# EAGLE design 519_jetson_nano (EAGLE 9.6.2)
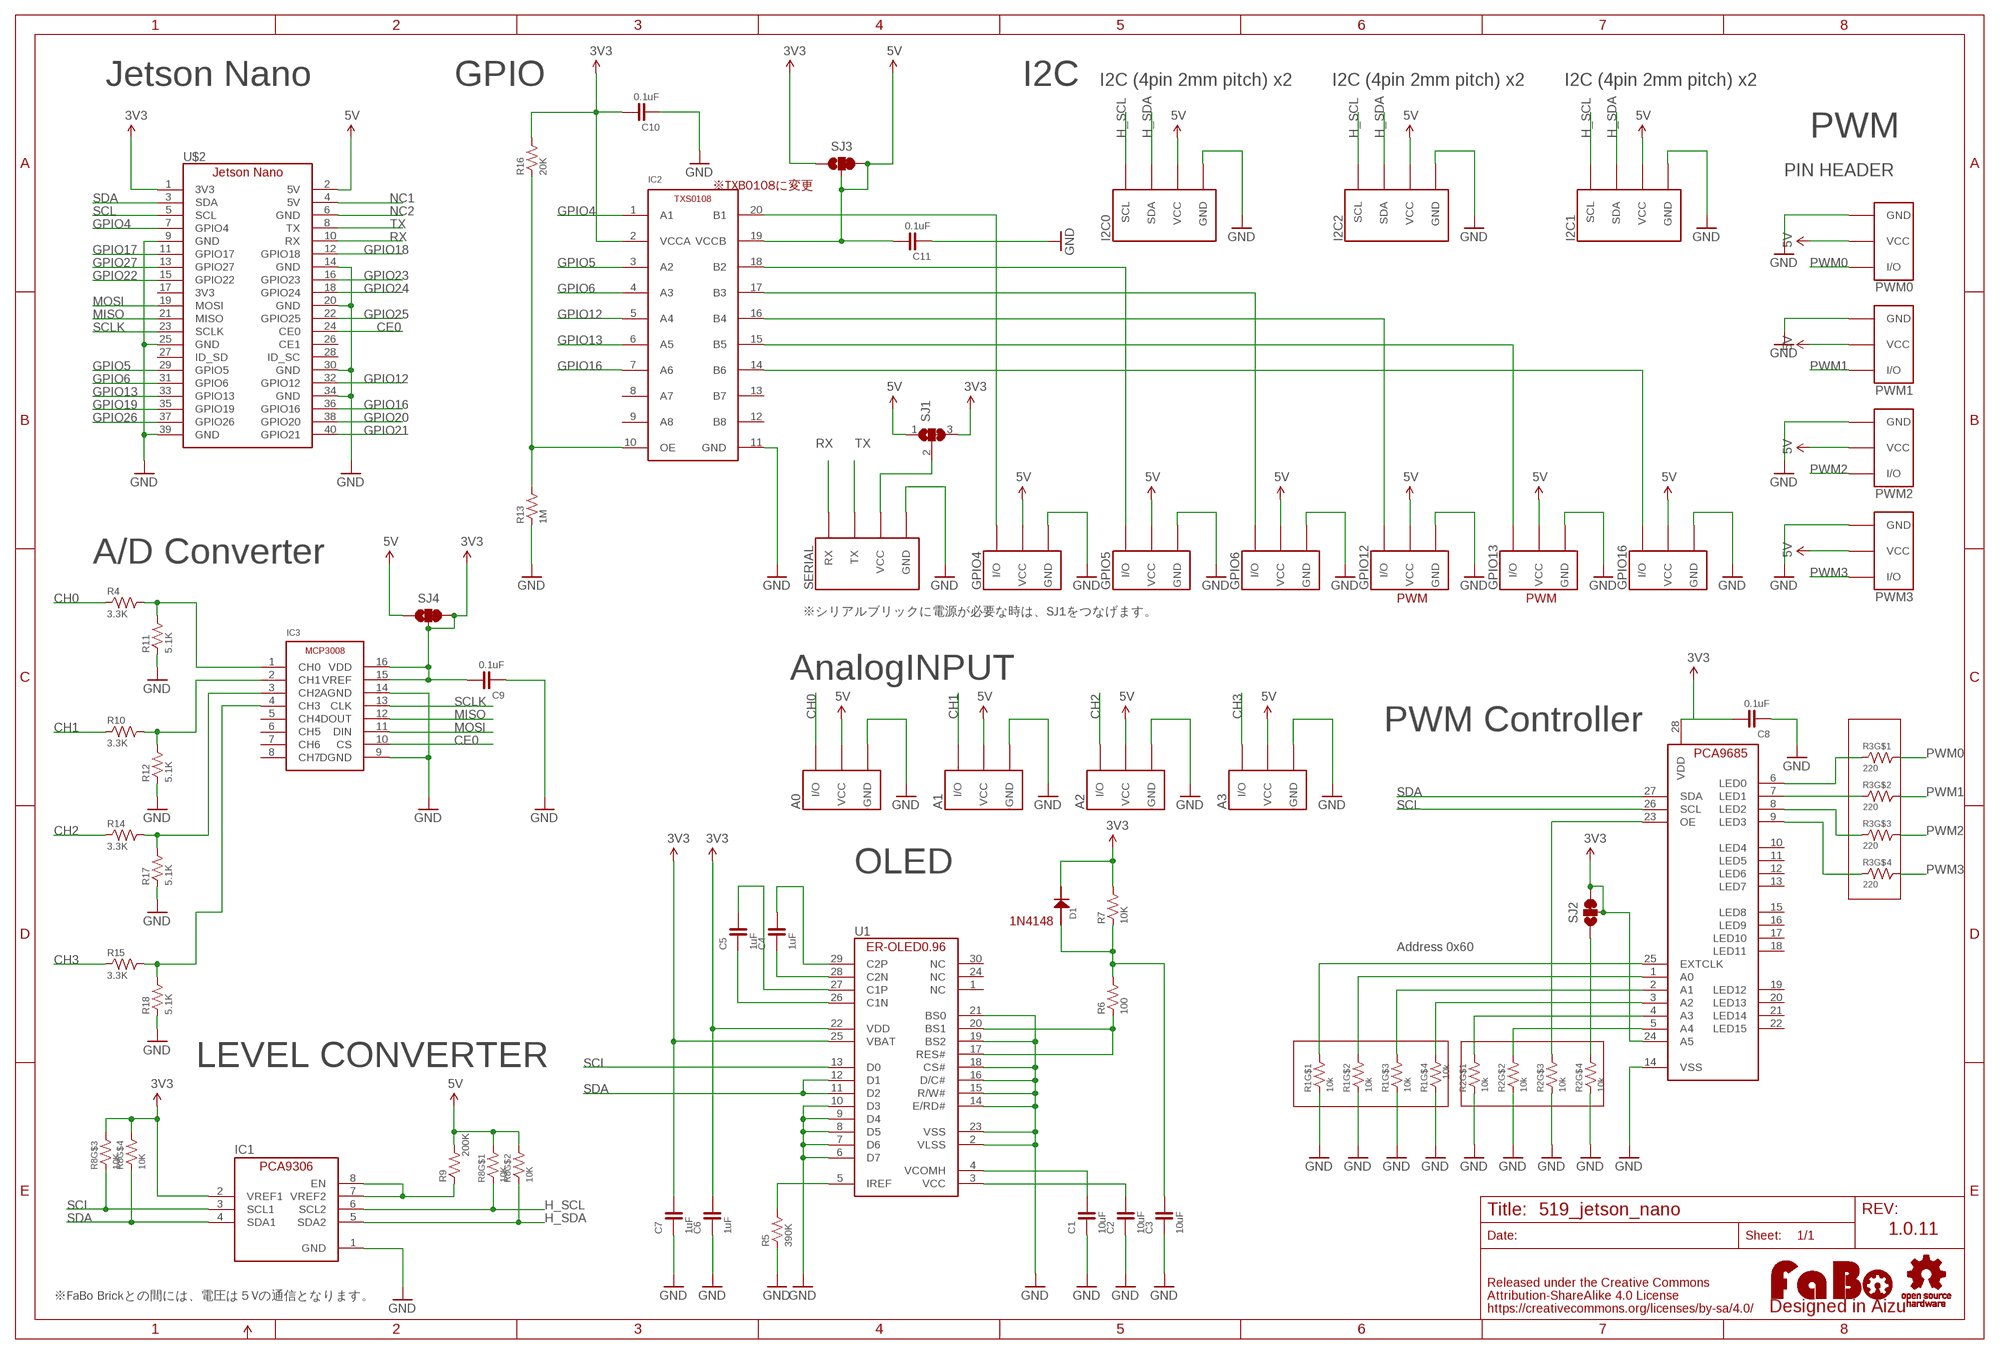
[diagram p0: schematic, sheet 1]

## Parts
A0  FABO_BRICK_3PIN-S03B-PASK-2  [FABO_BRICK_3PIN_S03B-PASK-2]
A1  FABO_BRICK_3PIN-S03B-PASK-2  [FABO_BRICK_3PIN_S03B-PASK-2]
A2  FABO_BRICK_3PIN-S03B-PASK-2  [FABO_BRICK_3PIN_S03B-PASK-2]
A3  FABO_BRICK_3PIN-S03B-PASK-2  [FABO_BRICK_3PIN_S03B-PASK-2]
C1  10uF  CAPACITOR-0603-BOTTOM  [0603-BOTTOM]
C2  10uF  CAPACITOR-0603-BOTTOM  [0603-BOTTOM]
C3  10uF  CAPACITOR-0603-BOTTOM  [0603-BOTTOM]
C4  1uF  CAPACITOR-0603-BOTTOM  [0603-BOTTOM]
C5  1uF  CAPACITOR-0603-BOTTOM  [0603-BOTTOM]
C6  1uF  CAPACITOR-0603-BOTTOM  [0603-BOTTOM]
C7  1uF  CAPACITOR-0603-BOTTOM  [0603-BOTTOM]
C8  0.1uF  CAPACITOR-0603  [0603]
C9  0.1uF  CAPACITOR-0603  [0603]
C10  0.1uF  CAPACITOR-0603  [0603]
C11  0.1uF  CAPACITOR-0603  [0603]
D1  1N4148  [1N4148W]
GPIO4  FABO_BRICK_3PIN-B03B-PASK-1  [FABO_BRICK_3PIN_B03B-PASK-1]
GPIO5  FABO_BRICK_3PIN-B03B-PASK-1  [FABO_BRICK_3PIN_B03B-PASK-1]
GPIO6  FABO_BRICK_3PIN-B03B-PASK-1  [FABO_BRICK_3PIN_B03B-PASK-1]
GPIO12  FABO_BRICK_3PIN-B03B-PASK-1  [FABO_BRICK_3PIN_B03B-PASK-1]
GPIO13  FABO_BRICK_3PIN-B03B-PASK-1  [FABO_BRICK_3PIN_B03B-PASK-1]
GPIO16  FABO_BRICK_3PIN-B03B-PASK-1  [FABO_BRICK_3PIN_B03B-PASK-1]
I2C0  FABO_BRICK_I2C-S04B-PASK-2  [FABO_BRICK_I2C_S04B-PASK-2]
I2C1  FABO_BRICK_I2C-B04B-PASK-1  [FABO_BRICK_I2C_B04B-PASK-1]
I2C2  FABO_BRICK_I2C-B04B-PASK-1  [FABO_BRICK_I2C_B04B-PASK-1]
IC1  PCA9306_SSOP  [8PIN-SSOP]
IC2  TXS0108  [R-PUSON-N20]
IC3  MICROCHIP-MCP3008  [MICROCHIP-MCP3008]
LOGO1  LOGO_FABO-M  [LOGO_FABO_M]
PWM0  FABO_BRICK_3PIN-HEADER  [FABO_BRICK_3PIN_HEADER]
PWM1  FABO_BRICK_3PIN-HEADER  [FABO_BRICK_3PIN_HEADER]
PWM2  FABO_BRICK_3PIN-HEADER  [FABO_BRICK_3PIN_HEADER]
PWM3  FABO_BRICK_3PIN-HEADER  [FABO_BRICK_3PIN_HEADER]
R1  10k  RESISTOR_ARRAY  [EXBV8V]
R2  10k  RESISTOR_ARRAY  [EXBV8V]
R3  220  RESISTOR_ARRAY  [EXBV8V]
R4  3.3K  RESISTOR-0603-BOTTOM  [0603-BOTTOM]
R5  390K  RESISTOR-0603-BOTTOM  [0603-BOTTOM]
R6  100  RESISTOR-0603-BOTTOM  [0603-BOTTOM]
R7  10K  RESISTOR-0603-BOTTOM  [0603-BOTTOM]
R8  10K  RESISTOR_ARRAY  [EXBV8V]
R9  200K  RESISTOR-0603  [0603]
R10  3.3K  RESISTOR-0603-BOTTOM  [0603-BOTTOM]
R11  5.1K  RESISTOR-0603-BOTTOM  [0603-BOTTOM]
R12  5.1K  RESISTOR-0603-BOTTOM  [0603-BOTTOM]
R13  1M  RESISTOR-0603-BOTTOM  [0603-BOTTOM]
R14  3.3K  RESISTOR-0603-BOTTOM  [0603-BOTTOM]
R15  3.3K  RESISTOR-0603-BOTTOM  [0603-BOTTOM]
R16  20K  RESISTOR-0603-BOTTOM  [0603-BOTTOM]
R17  5.1K  RESISTOR-0603-BOTTOM  [0603-BOTTOM]
R18  5.1K  RESISTOR-0603-BOTTOM  [0603-BOTTOM]
SERIAL  FABO_BRICK_SERIAL-B04B-PASK-1  [FABO_BRICK_SERIAL_B04B-PASK-1]
SJ1  SJ2W  [SJ_2]
SJ2  SMD-JUMPER-3-23SHORT  [SMD-JUMPER-3]
SJ3  SMD-JUMPER-3-23SHORT  [SMD-JUMPER-3]
SJ4  SMD-JUMPER-3-23SHORT  [SMD-JUMPER-3]
U1  ER-OLED0.96-1ER-CON30HT-1  [ER-CON30HT-1]
U$2  JETSON_NANO_WIDE  [JETSON_NANO_WIDE]
U$7  LOGO_OSHW-M_BOTTOM  [LOGO_OSHW_M_BOTTOM]
U$9  PCA9685  [PCA9685]

## Nets
3V3: C6.2 C7.2 C8.2 C9.2 C10.2 D1.CATHODE IC1.2(VREF1) IC2.2(VCCA) IC3.15(VREF) IC3.16(VDD) R7.2 R8.5 R8.6 R16.2 SJ1.3 SJ2.2 SJ2.3 SJ3.1 SJ4.2 SJ4.3 U1.22(VDD) U1.25(VBAT) U$2.1(3V3) U$9.24(A5) U$9.28(VDD)
5V: A0.VCC A1.VCC A2.VCC A3.VCC C11.2 GPIO4.VCC GPIO5.VCC GPIO6.VCC GPIO12.VCC GPIO13.VCC GPIO16.VCC I2C0.VCC I2C1.VCC I2C2.VCC IC2.19(VCCB) PWM0.VCC PWM1.VCC PWM2.VCC PWM3.VCC R8.7 R8.8 R9.2 SJ1.1 SJ3.2 SJ3.3 SJ4.1 U$2.2(5V)
CE0: IC3.10(CS) U$2.24(CE0)
CH0: A0.I/O R4.1
CH1: A1.I/O R10.1
CH2: A2.I/O R14.1
CH3: A3.I/O R15.1
GND: A0.GND A1.GND A2.GND A3.GND C1.1 C2.1 C3.1 C6.1 C7.1 C8.1 C9.1 C10.1 C11.1 GPIO4.GND GPIO5.GND GPIO6.GND GPIO12.GND GPIO13.GND GPIO16.GND I2C0.GND I2C1.GND I2C2.GND IC1.1(GND) IC2.11(GND) IC3.9(DGND) IC3.14(AGND) PWM0.GND PWM1.GND PWM2.GND PWM3.GND R1.1 R1.2 R1.3 R1.4 R2.1 R2.2 R2.3 R2.4 R5.1 R11.1 R12.1 R13.1 R17.1 R18.1 SERIAL.GND U1.2(VLSS) U1.6(D7) U1.7(D6) U1.8(D5) U1.9(D4) U1.10(D3) U1.14(E/RD#) U1.15(R/W#) U1.16(D/C#) U1.18(CS#) U1.19(BS2) U1.21(BS0) U1.23(VSS) U$2.9(GND) U$2.14(GND) U$2.20(GND) U$2.25(GND) U$2.30(GND) U$2.34(GND) U$2.39(GND) U$9.14(VSS)
GPIO4: IC2.1(A1) U$2.7(GPIO4)
GPIO5: IC2.3(A2) U$2.29(GPIO5)
GPIO6: IC2.4(A3) U$2.31(GPIO6)
GPIO12: IC2.5(A4) U$2.32(GPIO12)
GPIO13: IC2.6(A5) U$2.33(GPIO13)
GPIO16: IC2.7(A6) U$2.36(GPIO16)
GPIO17: U$2.11(GPIO17)
GPIO18: U$2.12(GPIO18)
GPIO19: U$2.35(GPIO19)
GPIO20: U$2.38(GPIO20)
GPIO21: U$2.40(GPIO21)
GPIO22: U$2.15(GPIO22)
GPIO23: U$2.16(GPIO23)
GPIO24: U$2.18(GPIO24)
GPIO25: U$2.22(GPIO25)
GPIO26: U$2.37(GPIO26)
GPIO27: U$2.13(GPIO27)
H_SCL: I2C0.SCL I2C1.SCL I2C2.SCL IC1.6(SCL2) R8.1
H_SDA: I2C0.SDA I2C1.SDA I2C2.SDA IC1.5(SDA2) R8.2
MISO: IC3.12(DOUT) U$2.21(MISO)
MOSI: IC3.11(DIN) U$2.19(MOSI)
N$2: R3.1 U$9.6(LED0)
N$3: R3.2 U$9.7(LED1)
N$4: R1.7 U$9.1(A0)
N$5: R3.3 U$9.8(LED2)
N$6: R3.4 U$9.9(LED3)
N$7: R2.6 U$9.23(OE)
N$8: R1.8 U$9.25(EXTCLK)
N$9: GPIO4.I/O IC2.20(B1)
N$10: R1.6 U$9.2(A1)
N$11: R1.5 U$9.3(A2)
N$12: R2.8 U$9.4(A3)
N$13: R2.7 U$9.5(A4)
N$14: C5.2 U1.27(C1P)
N$15: GPIO5.I/O IC2.18(B2)
N$16: C5.1 U1.26(C1N)
N$17: GPIO6.I/O IC2.17(B3)
N$18: GPIO12.I/O IC2.16(B4)
N$19: C4.1 U1.28(C2N)
N$20: GPIO13.I/O IC2.15(B5)
N$21: C4.2 U1.29(C2P)
N$22: GPIO16.I/O IC2.14(B6)
N$23: R5.2 U1.5(IREF)
N$24: C1.2 U1.4(VCOMH)
N$25: C2.2 U1.3(VCC)
N$26: R6.1 U1.17(RES#) U1.20(BS1)
N$27: C3.2 D1.ANODE R6.2 R7.1
N$28: IC2.10(OE) R13.2 R16.1
N$30: SERIAL.VCC SJ1.2
N$31: IC3.3(CH2) R14.2 R17.2
N$33: IC1.7(VREF2) IC1.8(EN) R9.1
N$34: IC3.1(CH0) R4.2 R11.2
N$35: R2.5 SJ2.1
N$36: IC3.2(CH1) R10.2 R12.2
N$38: IC3.4(CH3) R15.2 R18.2
NC1: U$2.4(5V)
NC2: U$2.6(GND)
PWM0: PWM0.I/O R3.8
PWM1: PWM1.I/O R3.7
PWM2: PWM2.I/O R3.6
PWM3: PWM3.I/O R3.5
RX: SERIAL.RX U$2.10(RX)
SCL: IC1.3(SCL1) R8.3 U1.13(D0) U$2.5(SCL) U$9.26(SCL)
SCLK: IC3.13(CLK) U$2.23(SCLK)
SDA: IC1.4(SDA1) R8.4 U1.11(D2) U1.12(D1) U$2.3(SDA) U$9.27(SDA)
TX: SERIAL.TX U$2.8(TX)
Unconnected: IC2.8(A7) IC2.9(A8) IC2.12(B8) IC2.13(B7) IC3.5(CH4) IC3.6(CH5) IC3.7(CH6) IC3.8(CH7) U1.1(NC) U1.24(NC) U1.30(NC) U$2.17(3V3) U$2.26(CE1) U$2.27(ID_SD) U$2.28(ID_SC) U$9.10(LED4) U$9.11(LED5) U$9.12(LED6) U$9.13(LED7) U$9.15(LED8) U$9.16(LED9) U$9.17(LED10) U$9.18(LED11) U$9.19(LED12) U$9.20(LED13) U$9.21(LED14) U$9.22(LED15)

## Notes on the sheet
- Jetson Nano | GPIO | I2C | I2C (4pin 2mm pitch) x2 | I2C (4pin 2mm pitch) x2 | I2C (4pin 2mm pitch) x2
- PWM
- PIN HEADER
- ※TXB0108に変更
- A/D Converter
- PWM | PWM
- ※シリアルブリックに電源が必要な時は、SJ1をつなげます。
- AnalogINPUT
- PWM Controller
- OLED
- 1N4148
- Address 0x60
- LEVEL CONVERTER
- 1.0.11
- ※FaBo Brickとの間には、電圧は５Vの通信となります。

## Library data of the parts
A0 A1-A3 GPIO4-GPIO6 GPIO12 GPIO13 GPIO16 PWM0 PWM1-PWM3 = FaBo-Template:FABO_BRICK_3PIN: FaBo Brick 3pin
C1-C11 = FaBo-Capacitor:CAPACITOR: CAPACITOR
D1 = FaBo-Diode:1N4148
I2C0 I2C1 I2C2 = FaBo-Template:FABO_BRICK_I2C: FaBo Brick I2C
IC1 = FaBo-LevelTranslator:PCA9306
IC2 = FaBo-LevelTranslator:TXS0108
IC3 = FaBo-ADC:MICROCHIP-MCP3008
LOGO1 = component:LOGO_FABO
R1-R3 R8 = component:RESISTOR_ARRAY
R4-R7 R9-R18 = FaBo-Resistors:RESISTOR: RESISTOR
SERIAL = FaBo-Template:FABO_BRICK_SERIAL: FaBo Brick Serial
SJ1 = jumper:SJ2W: SMD solder JUMPER
SJ2-SJ4 = FaBo-etc:SMD-JUMPER-3-23SHORT
U1 = FaBo-Display:ER-OLED0.96-1
U$2 = FaBo-Boards:JETSON_NANO
U$7 = component:LOGO_OSHW
U$9 = FaBo-Motor:PCA9685

## Board
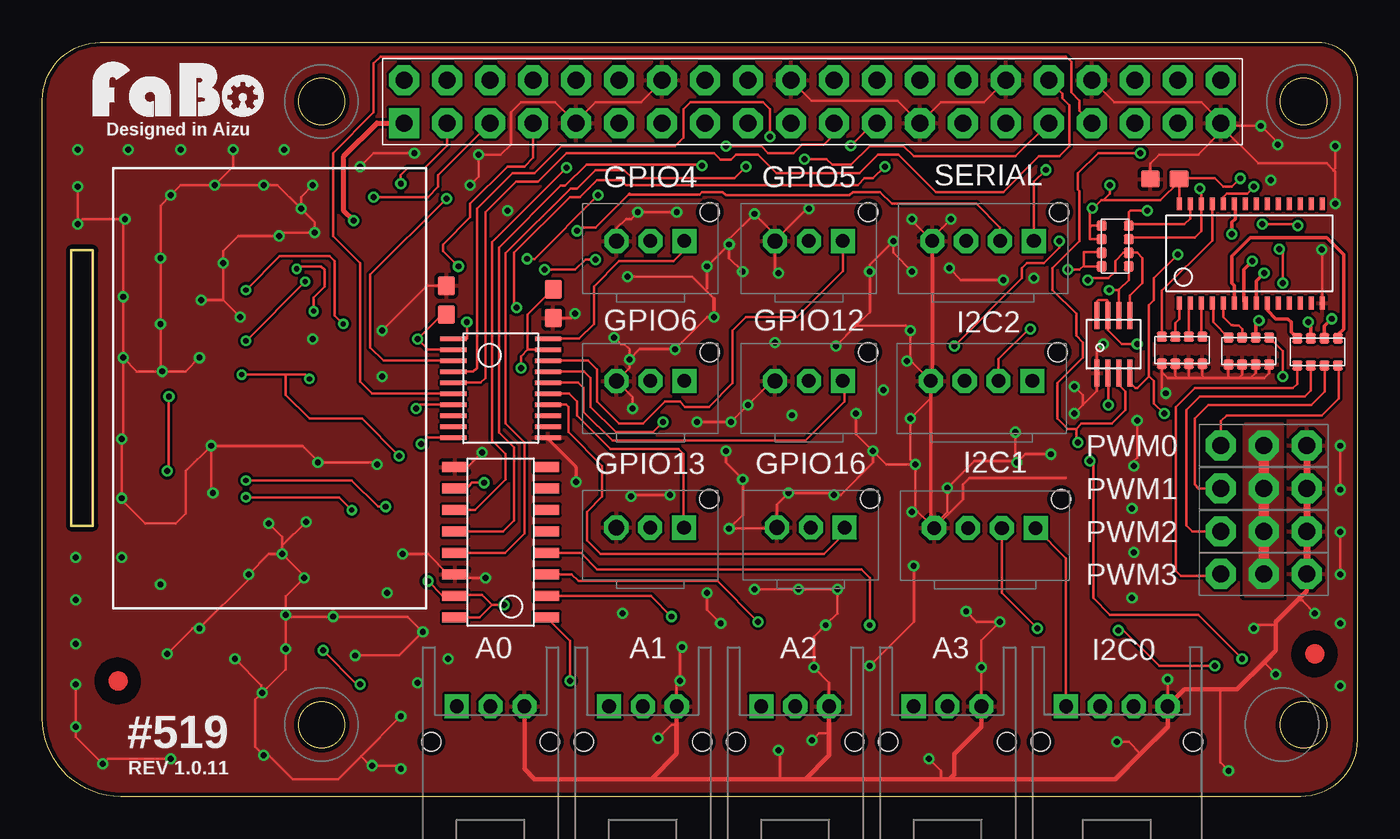
[diagram p1: board, top side]
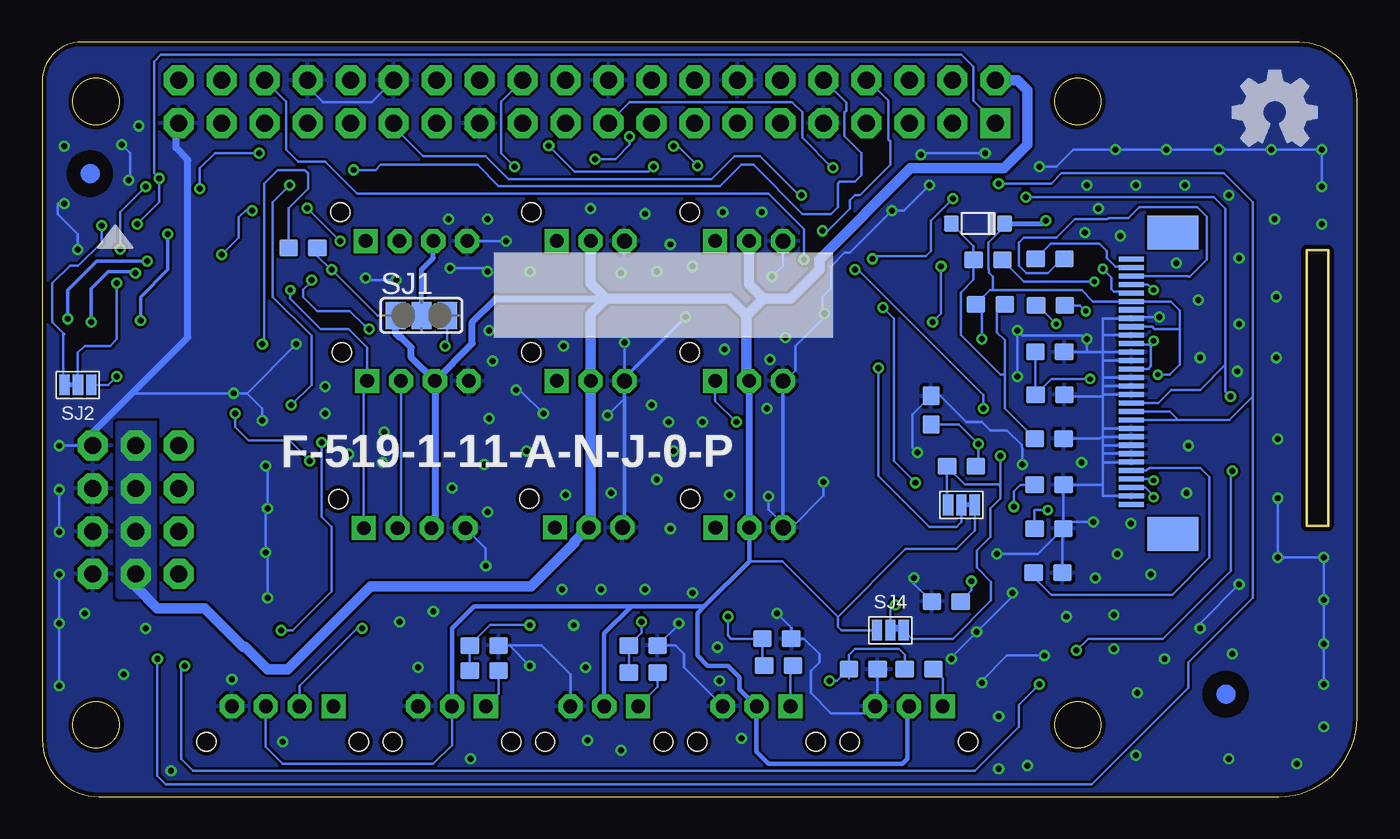
[diagram p2: board, bottom side, seen from below]

Size 74.16 x 39.58 mm. Coordinates in mm from the lower left corner, seen from the top.
Outline: 0,29.42 0,13.13 1.27,13.13 1.27,29.42 0,29.42
Outline: circle at 14.78,38.2 radius 1.38
Outline: circle at 14.78,1.38 radius 1.38
Outline: circle at 72.78,1.38 radius 1.38
Outline: circle at 72.78,38.2 radius 1.38
Copper layers (1*16): Top 0.035mm / dielectric 1.6mm / Bottom 0.035mm
Design rules "PCBway": minimum track width 6mil, minimum drill 12mil, track to track 6mil, track to pad 6mil, pad to pad 6mil, via to via 6mil, smd to smd 6mil, copper to edge 10mil, drill to drill 10mil, minimum pad ring 10mil, minimum via ring 6mil, stop-mask expansion 2mil, vias tented up to drill 100mil, thermal gap 8mil
bRestrict: 8 lines

### Footprints (pad centres in the part's own frame; a part is rotated, then mirrored left to right if it is on the bottom)
FABO_BRICK_3PIN_S03B-PASK-2 = drill 0.8 pad 1.422 octagon: GND -2,0; VCC 0,0 | drill 0.8 pad 1.422 square: I/O 2,0 | hole 1.1: 3.5,2.1; -3.5,2.1
0603-BOTTOM = smd 1.1 x 1 bottom: 1 -0.85,0; 2 0.85,0
0603 = smd 1.1 x 1: 1 -0.85,0; 2 0.85,0
1N4148W = smd 0.9 x 0.95: ANODE 0,0; CATHODE 3.15,0
FABO_BRICK_3PIN_B03B-PASK-1 = drill 0.9 pad 1.422 octagon: GND -2,0 | drill 0.8 pad 1.422 square: I/O 2,0 | drill 0.8 pad 1.422 octagon: VCC 0,0 | hole 1.1: 3.5,1.7
FABO_BRICK_I2C_S04B-PASK-2 = drill 0.8 pad 1.422 octagon: GND -3,0; SDA 1,0; VCC -1,0 | drill 0.8 pad 1.422 square: SCL 3,0 | hole 1.1: 4.5,2.1; -4.5,2.1
FABO_BRICK_I2C_B04B-PASK-1 = drill 0.8 pad 1.422 octagon: GND -3,0; SDA 1,0; VCC -1,0 | drill 0.8 pad 1.422 square: SCL 3,0 | hole 1.1: 4.5,1.7
8PIN-SSOP = smd 0.3 x 1.6: 1 -0.975,-1.7; 2 -0.325,-1.7; 3 0.325,-1.7; 4 0.975,-1.7; 5 0.975,1.7; 6 0.325,1.7; 7 -0.325,1.7; 8 -0.975,1.7
R-PUSON-N20 = smd 0.25 x 1.55: 1 -2.925,-2.8; 2 -2.275,-2.8; 3 -1.625,-2.8; 4 -0.975,-2.8; 5 -0.325,-2.8; 6 0.325,-2.8; 7 0.975,-2.8; 8 1.625,-2.8; 9 2.275,-2.8; 10 2.925,-2.8; 11 2.925,2.8; 12 2.275,2.8; 13 1.625,2.8; 14 0.975,2.8; 15 0.325,2.8; 16 -0.325,2.8; 17 -0.975,2.8; 18 -1.625,2.8; 19 -2.275,2.8; 20 -2.925,2.8
MICROCHIP-MCP3008 = smd 0.6 x 1.5: 1 -4.445,-2.7; 2 -3.175,-2.7; 3 -1.905,-2.7; 4 -0.635,-2.7; 5 0.635,-2.7; 6 1.905,-2.7; 7 3.175,-2.7; 8 4.445,-2.7; 9 4.445,2.7; 10 3.175,2.7; 11 1.905,2.7; 12 0.635,2.7; 13 -0.635,2.7; 14 -1.905,2.7; 15 -3.175,2.7; 16 -4.445,2.7
FABO_BRICK_3PIN_HEADER = drill 1 pad 1.778 octagon: GND -2.54,0; I/O 2.54,0; VCC 0,0
EXBV8V = smd 0.6 x 0.6: 1 -1.2,-0.8; 2 -0.4,-0.8; 3 0.4,-0.8; 4 1.2,-0.8; 5 1.2,0.8; 6 0.4,0.8; 7 -0.4,0.8; 8 -1.2,0.8
FABO_BRICK_SERIAL_B04B-PASK-1 = drill 0.8 pad 1.422 octagon: GND -3,0; TX 1,0; VCC -1,0 | drill 0.8 pad 1.422 square: RX 3,0 | hole 1.1: 4.5,1.7
SJ_2 = smd 1.168 x 1.6: 1 -1.524,0; 2 0,0; 3 1.524,0
SMD-JUMPER-3 = smd 0.61 x 1.219: 1 -0.787,0; 2 0,0; 3 0.787,0
ER-CON30HT-1 = smd 0.3 x 1.5 bottom: 1 7,-0.23; 2 6.5,-0.23; 3 6,-0.23; 4 5.5,-0.23; 5 5,-0.23; 6 4.5,-0.23; 7 4,-0.23; 8 3.5,-0.23; 9 3,-0.23; 10 2.5,-0.23; 11 2,-0.23; 12 1.5,-0.23; 13 1,-0.23; 14 0.5,-0.23; 15 0,-0.23; 16 -0.5,-0.23; 17 -1,-0.23; 18 -1.5,-0.23; 19 -2,-0.23; 20 -2.5,-0.23; 21 -3,-0.23; 22 -3.5,-0.23; 23 -4,-0.23; 24 -4.5,-0.23; 25 -5,-0.23; 26 -5.5,-0.23; 27 -6,-0.23; 28 -6.5,-0.23; 29 -7,-0.23; 30 -7.5,-0.23 | smd 2 x 3 bottom: 31 -9.07,-2.67; 32 8.74,-2.67
JETSON_NANO_WIDE = drill 1 pad 1.778 square: 1 21.59,39.37 | drill 1 pad 1.778 octagon: 2 21.59,41.91; 3 24.13,39.37; 4 24.13,41.91; 5 26.67,39.37; 6 26.67,41.91; 7 29.21,39.37; 8 29.21,41.91; 9 31.75,39.37; 10 31.75,41.91; 11 34.29,39.37; 12 34.29,41.91; 13 36.83,39.37; 14 36.83,41.91; 15 39.37,39.37; 16 39.37,41.91; 17 41.91,39.37; 18 41.91,41.91; 19 44.45,39.37; 20 44.45,41.91; 21 46.99,39.37; 22 46.99,41.91; 23 49.53,39.37; 24 49.53,41.91; 25 52.07,39.37; 26 52.07,41.91; 27 54.61,39.37; 28 54.61,41.91; 29 57.15,39.37; 30 57.15,41.91; 31 59.69,39.37; 32 59.69,41.91; 33 62.23,39.37; 34 62.23,41.91; 35 64.77,39.37; 36 64.77,41.91; 37 67.31,39.37; 38 67.31,41.91; 39 69.85,39.37; 40 69.85,41.91
PCA9685 = smd 0.3 x 0.75: 1 -4.15,-2.93; 2 -3.5,-2.93; 3 -2.85,-2.93; 4 -2.2,-2.93; 5 -1.55,-2.93; 6 -0.9,-2.93; 7 -0.25,-2.93; 8 0.4,-2.93; 9 1.05,-2.93; 10 1.7,-2.93; 11 2.35,-2.93; 12 3,-2.93; 13 3.65,-2.93; 14 4.3,-2.93; 15 4.3,2.92; 16 3.65,2.92; 17 3,2.92; 18 2.35,2.92; 19 1.7,2.92; 20 1.05,2.92; 21 0.4,2.92; 22 -0.25,2.92; 23 -0.9,2.92; 24 -1.55,2.92; 25 -2.2,2.92; 26 -2.85,2.92; 27 -3.5,2.92; 28 -4.15,2.92

### Placement (x,y rotation side)
A0  24.76,2.47 180 top
A1  33.76,2.47 180 top
A2  42.76,2.47 180 top
A3  51.76,2.47 180 top
C1  16.48,15.55 0 top
C2  16.49,12.97 0 top
C3  16.47,18.29 0 top
C4  16.43,28.91 0 top
C5  16.4,26.16 0 top
C6  16.43,20.89 0 top
C7  16.44,23.42 0 top
C8  64.59,33.63 0 top
C9  22.56,8.66 0 bottom
C10  22.16,26.46 270 top
C11  28.46,26.27 90 top
D1  22.26,31 0 bottom
GPIO4  34.21,29.96 0 top
GPIO5  43.57,29.96 0 top
GPIO6  34.21,21.7 0 top
GPIO12  43.57,21.7 0 top
GPIO13  34.19,13.03 0 top
GPIO16  43.68,13.04 0 top
I2C0  61.76,2.47 180 top
I2C1  53.97,13 0 top
I2C2  53.77,21.7 0 top
IC1  61.56,23.87 0 top
IC2  25.36,21.27 270 top
IC3  25.36,12.16 90 top
LOGO1  6.32,36.93 0 top
PWM0  70.45,17.89 180 top
PWM1  70.44,15.35 180 top
PWM2  70.44,12.8 180 top
PWM3  70.44,10.29 180 top
R1  65.62,23.51 0 top
R2  69.56,23.46 0 top
R3  73.62,23.42 180 top
R4  24.16,4.66 0 top
R5  16.54,10.35 0 top
R6  20.09,28.85 0 top
R7  19.95,26.24 0 top
R8  61.66,29.67 90 top
R9  60.56,29.57 0 bottom
R10  32.46,4.87 0 top
R11  27.46,4.66 0 top
R12  32.56,6.46 0 top
R13  23.46,19.96 270 top
R14  40.46,4.46 0 top
R15  49.86,4.56 0 top
R16  21.66,16.67 0 top
R17  40.46,6.06 0 top
R18  49.86,6.06 0 top
SERIAL  53.86,29.96 0 top
SJ1  53.56,25.57 0 bottom
SJ2  73.86,21.46 180 bottom
SJ3  21.66,14.37 0 bottom
SJ4  25.86,6.96 0 bottom
U1  11.85,21.39 270 top
U$2  -1.94,-2.44 0 top
U$3  [MARK_POINT_3MM]  2.76,3.97 0 top
U$4  [MARK_POINT_3MM]  73.46,5.56 0 top
U$5  [MARK_POINT_3MM]  6.03,3.19 0 bottom
U$6  [MARK_POINT_3MM]  73.13,33.95 0 bottom
U$7  3.14,37.57 0 top
U$9  69.59,29.23 0 top

### Tracks (layer width: path | path; a pad name or v marks a point on that pad's centre or on a via)
3V3  (via drill 0.3, 0.35)
  Top 0.152: v14.06,21.82 13.81,22.07 12.66,22.07 | v10.06,22.07 12.66,22.07 | R8.6 60.16,30.07 60.16,30.77 | 60.16,30.77 60.26,30.86 R8.5 | 60.16,30.77 60.16,31.67 60.31,31.82 v60.31,31.92 60.41,31.92 60.86,32.36 60.96,32.36 | U$9.28 65.44,33.46 | 65.44,33.46 C8.2 | C8.2 | C8.2 65.49,33.66 67.56,33.66 68.04,33.18 68.04,33.16 68.56,33.16 v69.06,33.66 | 65.44,33.46 64.34,32.36 60.96,32.36 | IC1.2 61.26,22.14 v61.26,20.27 | v61.36,33.27 61.36,32.77 60.96,32.36 | C10.2 21.91,25.62 v20.46,24.17 21.08,23.54 IC2.2 | v19.36,17.27 17.16,19.46 14.06,19.46 12.66,20.87 12.66,22.07 | v52.16,23.77 56.16,27.77 56.16,28.37 56.46,28.67 57.46,28.67 58.36,29.57 v58.36,29.96 | v72.46,30.86 72.36,30.96 v70.36,30.96 | v21.06,9.87 21.93,8.99 IC3.15 22.73,9.06 24.26,9.06 24.86,8.46 | v25.56,8.46 24.86,8.46 | IC3.16 24.11,7.72 24.86,8.46 | v71.56,27.46 71.56,29.29 v71.36,29.49 | v69.86,33.16 69.46,32.77 68.26,32.77 68.04,32.55 U$9.24
  Top 0.305: v16.66,31.17 16.06,31.77 16.06,34.95 18.05,36.93 U$2.1
  Bottom 0.152: 19.81,27.07 14.56,27.07 13.89,26.39 U1.25 9.29,26.39 8.76,25.87 8.76,24.77 | 19.81,27.07 19.81,27.87 20.04,28.09 20.04,28.29 20.06,28.32 20.06,29.86 19.11,30.82 D1.CATHODE | v61.26,20.27 60.06,21.46 60.06,24.37 62.36,26.67 62.36,32.27 v61.36,33.27 | v10.06,22.07 9.36,22.07 8.76,22.67 8.76,24.77 | 19.81,27.07 19.97,27.07 R7.2 20.46,25.89 v20.46,24.17 | U1.22 10.39,24.89 10.26,24.77 8.76,24.77 | C7.2 C6.2 16.35,21.82 v14.06,21.82 | v19.36,17.27 19.36,15.56 19.46,15.56 | U$2.1 20.96,38.24 20.96,40.27 21.66,40.96 68.96,40.96 69.36,40.56 69.36,33.96 v69.06,33.66 69.06,32.27 v70.36,30.96 | SJ1.3 52.04,23.89 v52.16,23.77 | v58.36,29.96 v60.31,31.92 | 74.66,24.46 74.71,24.52 | 74.71,24.52 75.36,25.17 75.36,27.46 74.32,28.51 73.83,28.51 72.46,29.88 v72.46,30.86 | R16.2 22.46,16.62 | R16.2 22.51,16.62 21.46,15.56 19.46,15.56 | 19.46,15.56 19.36,15.46 19.36,14.76 19.96,14.17 19.96,12.46 20.76,11.66 20.76,10.66 19.91,9.81 19.91,8.71 22.16,6.46 24.57,6.46 SJ4.3 | v21.06,9.87 21.06,9.31 C9.2 | 25.76,7.06 SJ4.2 25.86,8.16 v25.56,8.46 | R16.2 22.51,14.43 SJ3.1 | 73.86,21.87 SJ2.2 73.86,23.37 73.46,23.77 71.96,23.77 71.56,24.17 v71.56,27.46 | v71.36,29.49 71.36,31.67 v69.86,33.16 | 74.71,24.52 74.71,21.53 SJ2.3
  Bottom 0.305: D1.CATHODE 16.83,31 v16.66,31.17 | SJ2.2 SJ2.3
  Bottom 0.406: SJ4.3 25.17,7.06 25.76,7.06
5V  (via drill 0.35)
  Top 0.152: R8.7 60.86,29.32 59.81,29.32 59.81,28.52 | R8.8 59.86,28.46 59.81,28.52 | v58.86,28.27 59.56,28.27 59.81,28.52 | C11.2 26.96,25.62 26.96,23.54 | 26.96,23.54 IC2.19 | v26.56,22.46 26.56,23.14 26.96,23.54
  Top 0.61: PWM0.VCC PWM1.VCC PWM2.VCC PWM3.VCC
  Bottom 0.152: R9.2 59.71,29.07 58.91,28.27 v58.86,28.27 56.16,25.57 SJ1.1 | SJ3.3 20.86,14.35 20.86,12.87 21.96,11.76 24.96,11.76 28.96,7.76 | A3.VCC 51.76,0.17 52.86,-0.94 61.76,-0.94 62.76,0.06 I2C0.VCC | 28.96,7.76 28.96,7.16 28.76,6.96 SJ4.1 | SJ3.2 21.66,14.26 21.66,13.37 21.96,13.06 23.56,13.06 26.56,16.07 v26.56,22.46 | 34.19,11.04 32.23,11.04 28.96,7.76
  Bottom 0.254: GPIO13.VCC 34.19,11.04 36.86,8.37 | A3.VCC 51.76,7.06 50.46,8.37 41.16,8.37 | 36.86,8.37 37.26,7.96 37.26,5.46 36.66,4.87 35.46,4.87 34.76,4.16 34.76,3.47 A1.VCC 33.76,-0.23 33.06,-0.94 25.16,-0.94 24.86,-0.64 24.86,2.36 A0.VCC | 36.86,8.37 41.16,8.37 | A2.VCC 42.76,6.76 41.16,8.37
  Bottom 0.305: SJ3.3 21.56,14.37 21.66,14.26
  Bottom 0.406: GPIO13.VCC 34.19,21.68 GPIO6.VCC | I2C2.VCC 52.77,13.21 I2C1.VCC | I2C2.VCC 50.56,23.91 50.56,25.17 49.16,26.57 42.66,26.57 | I2C2.VCC 54.16,23.09 54.16,23.67 54.76,24.27 54.86,24.27 55.08,24.49 SJ1.1
  Bottom 0.61: U$2.2 18.36,39.46 17.76,38.86 17.76,35.66 19.16,34.27 24.66,34.27 30.06,28.87 30.06,28.27 31.76,26.57 33.36,26.57 | 33.36,26.57 34.36,25.57 | 34.36,25.57 34.36,21.85 34.19,21.68 | 34.36,25.57 35.36,26.57 42.66,26.57 | 42.66,26.57 43.57,25.66 GPIO12.VCC 43.57,13.14 GPIO16.VCC 44.51,12.2 44.51,12.13 47.08,9.56 56.56,9.56 61.46,4.66 62.66,4.66 63.98,5.98 64.09,5.98 66.37,8.26 69.16,8.26 70.44,9.54 PWM3.VCC | GPIO5.VCC 43.57,27.48 42.66,26.57 | GPIO4.VCC 34.21,27.42 33.36,26.57
  pour Top (no thermals): 69.36,19.17 71.56,19.17 71.56,8.96 69.36,8.96 69.26,9.06 69.26,19.07
  pour Bottom (no thermals): 69.36,19.27 71.46,19.27 71.56,19.17 71.56,8.96 71.46,8.87 69.26,8.87 69.26,19.27
CE0  (via drill 0.35)
  Top 0.152: IC3.10 22.79,15.46 23.46,15.46 23.68,15.68 v24.39,15.68 | v26.3,26.02 26.16,26.17 26.16,29.27 29.45,32.56 29.69,32.56 | 29.69,32.56 29.76,32.56 | 29.69,32.56 30.05,32.56 31.06,33.56 32.46,33.56 32.76,33.27 46.46,33.27 46.86,33.66 47.36,33.66 v48.06,34.36
  Bottom 0.152: v24.39,15.68 25.66,16.95 25.66,25.38 v26.3,26.02 | v48.06,34.36 48.86,35.16 48.86,38.2 U$2.24
CH0
  Bottom 0.152: A0.I/O 22.76,4.12 R4.1
CH1
  Bottom 0.152: A1.I/O 31.76,4.71 R10.1
CH2
  Bottom 0.152: A2.I/O 39.61,3.61 R14.1
CH3
  Bottom 0.152: A3.I/O 49.01,3.22 R15.1
GND  (via drill 0.35)
  Top 0.152: R2.1 68.36,21.96 68.46,21.87 | 68.46,21.87 68.96,21.87 | 68.96,21.87 69.16,22.07 R2.2 | R2.3 69.96,22.17 69.66,21.87 | 69.66,21.87 68.96,21.87 | R1.4 66.82,22.01 66.96,21.87 | 66.96,21.87 68.46,21.87 | 65.36,21.87 64.76,21.87 64.42,22.21 R1.1 64.42,21.21 v64.66,20.96 | 65.36,21.87 65.96,21.87 | 65.96,21.87 66.96,21.87 | R1.3 66.02,21.92 65.96,21.87 | R1.2 65.22,22.01 65.36,21.87 | U$9.14 73.89,29.43 v73.86,29.46 | C8.1 63.73,34.54 64.26,35.06 66.56,35.06 67.91,36.41 67.91,36.77 | v60.96,23.87 60.96,23.77 60.59,23.39 IC1.1 60.59,21.09 59.76,20.27 | I2C1.GND 52.66,14.69 52.66,15.56 53.06,15.96 58.76,15.96 | v32.86,27.87 36.67,27.87 37.47,27.07 | 37.47,27.07 37.96,26.58 | v74.66,32.16 74.66,34.06 74.56,34.16 | 74.56,34.16 74.16,34.56 70.11,34.56 68.03,36.64 | 8.96,26.46 v9.96,25.46 | 8.96,26.46 v8.96,28.67 8.96,29.37 9.86,30.27 v12.26,30.27 12.46,30.46 v14.36,30.46 14.36,31.07 v13.56,31.86 | U$2.34 61.6,38.16 66.76,38.16 67.91,37.02 U$2.39 67.91,36.77 | 68.03,36.64 67.91,36.77 | U$2.30 53.9,38.16 51.36,38.16 U$2.25 48.8,38.27 43.72,38.27 U$2.20 | U$2.14 34.89,39.39 33.66,38.16 30.96,38.16 29.81,37.02 U$2.9 28.58,38.16 26.56,38.16 25.96,37.56 25.96,35.66 25.36,35.06 v24.06,35.06 24.06,33.77 v23.56,33.27 | v33.16,20.07 33.16,20.75 GPIO6.GND 32.96,22.45 v32.96,22.96 | v32.06,24.27 32.46,23.87 32.66,23.87 32.96,23.57 v32.96,22.96 | v37.96,25.46 37.56,25.46 v35.66,23.57 33.56,23.57 v32.96,22.96 | GPIO4.GND 32.21,30.71 32.76,31.27 33.06,31.27 v33.46,31.67 v35.76,31.67 | v38.86,29.77 v37.56,28.46 37.56,27.17 37.47,27.07 | v38.86,29.77 38.86,30.07 v40.36,31.57 41.57,30.36 GPIO5.GND
  Top 0.152: v43.56,31.86 43.46,31.86 GPIO5.GND | v38.66,17.57 38.66,16.87 v39.66,15.87 39.66,13.76 v38.86,12.96 41.61,12.96 GPIO16.GND 41.68,14.38 v42.36,15.06 44.96,15.06 v45.06,14.96 45.46,14.96 47.36,16.87 v47.36,17.57 | GPIO12.GND 41.39,21.7 v39.96,20.27 v38.96,19.27 v36.96,19.27 | v33.06,14.87 33.16,14.96 v35.36,14.96 | v45.16,23.77 46.36,24.96 | 46.36,24.96 49.26,24.96 v49.56,24.67 49.56,23.07 v49.36,22.87 49.6,22.87 I2C2.GND 50.77,20.68 v49.56,19.46 49.56,17.07 v49.86,16.77 | v46.36,19.77 46.36,18.57 v47.36,17.57 | v47.36,17.57 48.16,16.77 v49.86,16.77 | v49.86,16.77 49.86,14.17 49.71,14.01 | 49.71,14.01 v49.66,13.96 | 49.71,14.01 49.96,14.01 50.89,13.09 51.76,13.96 v51.76,15.37 53.36,16.96 55.76,16.96 | v55.76,18.67 55.76,16.96 | 55.76,16.96 v55.86,16.87 56.36,17.37 v57.86,17.37 | v62.76,16.67 62.76,16.96 62.96,17.17 v62.96,19.37 | v49.66,28.17 48.56,29.27 v48.56,29.96 47.16,28.57 v47.16,28.17 47.16,25.77 46.36,24.96 | v55.06,27.67 52.56,27.67 v51.86,28.37 | 17.11,-0.49 15.76,-1.83 13.06,-1.83 11.66,-0.44 v11.36,-0.44 10.86,0.06 10.86,2.86 11.21,3.22 | 17.11,-0.49 v19.46,1.86 | 11.21,3.22 v11.26,3.27 12.66,4.66 v12.66,5.87 v12.66,7.87 | v12.66,7.87 12.66,8.96 13.66,9.96 | 13.66,9.96 v13.76,10.06 | v5.66,5.56 7.16,7.06 v7.56,7.06 10.46,9.96 v10.46,10.26 11.66,11.46 v12.46,11.46 | v12.46,11.46 13.66,10.26 13.66,9.96 | v12.46,11.46 12.46,11.96 v13.86,13.37 | v11.66,13.26 12.46,12.46 v12.46,11.46 | v5.36,22.27 5.26,22.37 v5.26,25.07 v5.26,28.96 5.26,32.06 v5.86,32.66 6.46,33.27 v8.46,33.27 | v8.46,33.27 9.56,34.36 v9.56,35.36 | v8.46,33.27 v11.36,33.27 12.16,33.27 v13.56,31.86
  Top 0.152: v13.56,31.86 13.56,32.56 v14.26,33.27 | v5.36,22.27 6.76,22.27 v7.56,23.07 | v5.36,22.27 3.86,22.27 v3.06,23.07 | v3.06,23.07 v3.06,26.67 3.06,31.17 v3.16,31.27 0.66,31.27 v0.36,30.96 v0.36,33.16 | v3.06,23.07 3.06,18.37 v2.96,18.27 v2.96,14.76 2.96,14.67 4.36,13.26 6.16,13.26 6.76,13.87 6.76,16.37 v8.26,17.87 | v8.26,17.87 8.26,15.17 v8.36,15.06 | v8.26,17.87 13.66,17.87 14.56,16.96 v14.56,16.87 17.96,16.87 v18.06,16.77 | v7.66,26.46 8.96,26.46 | v16.76,5.46 19.36,5.46 v20.76,6.87 19.86,7.76 v15.46,7.76 12.76,7.76 v12.66,7.87 | v71.26,35.66 71.26,35.77 v70.26,36.77 68.16,36.77 68.03,36.64 | v17.06,34.36 17.86,35.16 v20.26,35.16 | v74.66,35.56 74.66,34.27 74.56,34.16 | 59.76,20.27 v59.26,19.77 | v59.26,21.37 59.76,20.87 59.76,20.27 | R2.4 70.76,22.17 70.46,21.87 69.66,21.87 | v24.46,10.06 22.86,10.06 IC3.14 22.26,10.26 21.06,11.46 v19.56,11.46 | v24.26,17.46 23.4,16.61 IC3.9 | C11.1 29.51,25.42 v29.76,25.67 | v74.96,17.87 v74.96,15.26 | v74.96,12.76 v74.96,10.26 | v49.76,10.76 49.76,7.46 v47.16,4.87 | v18.36,24.67 21.01,27.32 C10.1 | A1.GND 35.76,3.77 v35.96,3.97 35.96,5.87 v36.06,5.96 | v61.76,0.36 62.46,0.36 63.16,-0.33 | A3.GND v53.76,4.77 53.76,6.37 v54.86,7.46 53.46,7.46 v52.86,8.06 | A2.GND 44.76,3.86 v43.86,4.77 43.86,6.56 v44.56,7.26 45.26,7.96 v45.26,9.37 v42.96,9.37 v40.36,9.37 | v38.36,7.37 37.56,8.16 v37.56,9.16 | v50.66,-0.64 51.36,-1.33 51.36,-1.83 | v41.76,-0.14 41.86,-0.23 41.86,-1.83 | v43.76,0.46 44.16,0.86 44.76,0.86 | v34.66,0.56 35.46,1.36 35.76,1.36 | v71.16,4.37 70.56,4.96 70.56,5.16 | v69.86,7.06 70.06,7.26 71.16,7.26 | 72.41,8.71 72.71,8.71 v73.46,7.96
  Top 0.152: v68.36,-1.33 67.86,-0.83 67.86,3.47 | 17.11,-0.49 17.66,-1.04 v17.76,-1.04 19.26,-1.04 v19.46,-1.24 | v0.26,3.77 v0.26,1.27 0.26,0.67 v1.86,-0.94 2.16,-0.64 v5.86,-0.64 | v49.66,31.27 49.66,31.17 SERIAL.GND 50.86,30.17 v51.96,31.27 | v41.76,28.07 41.57,28.26 GPIO5.GND | v39.66,28.17 38.86,28.96 v38.86,29.77 | I2C0.GND v64.76,4.06 | v9.66,5.27 11.21,3.72 11.21,3.22
  Top 0.2: 37.96,26.58 v37.96,25.46 | SERIAL.GND 50.86,21.79 I2C2.GND 50.77,13.21 50.89,13.09 I2C1.GND | IC2.11 28.16,18.27 29.81,16.62 v29.81,15.71
  Top 0.254: A0.GND 26.76,-1.24 27.36,-1.83 34.26,-1.83 | A1.GND 35.76,1.36 35.76,-0.33 34.26,-1.83 | A2.GND 44.76,0.86 44.76,-0.44 43.36,-1.83 | 43.36,-1.83 41.86,-1.83 34.26,-1.83 | A3.GND 53.76,1.27 52.16,-0.33 52.16,-1.54 51.86,-1.83 | 51.86,-1.83 51.36,-1.83 43.36,-1.83 | 51.86,-1.83 61.66,-1.83 63.16,-0.33 64.76,1.27 I2C0.GND 65.76,3.47 67.86,3.47 68.86,3.47 70.56,5.16 71.16,5.76 71.16,7.26 71.16,7.46 72.41,8.71 72.98,9.29 PWM3.GND
  Top 0.406: PWM0.GND PWM1.GND PWM2.GND PWM3.GND
  Bottom 0.152: U1.2 13.3,14.89 13.3,15.56 | U1.6 11.62,16.87 13.3,16.87 | 13.3,15.56 13.3,16.87 | U1.7 13.3,17.39 | 13.3,17.39 13.3,16.87 | U1.8 13.3,17.89 | 13.3,17.89 13.3,17.39 | U1.9 13.3,18.39 | 13.3,18.39 13.3,17.89 | U1.14 13.3,20.89 | 13.3,20.89 13.3,20.77 | 13.3,20.77 13.3,18.87 | 13.3,18.87 13.3,18.46 | 13.3,18.46 13.3,18.39 | U1.15 13.3,21.39 | 13.3,21.39 13.3,20.89 | U1.16 13.3,21.89 | 13.3,21.89 13.3,21.39 | U1.18 13.3,22.89 | 13.3,22.89 13.3,21.89 | U1.19 13.3,23.39 | 13.3,23.39 13.3,22.89 | U1.21 13.3,24.39 | 13.3,24.39 13.3,23.46 | 13.3,23.46 13.3,23.39 | 13.3,24.39 13.3,25.39 U1.23 11.55,25.46 v9.96,25.46 | 70.61,21.02 70.56,20.96 v64.66,20.96 63.86,20.96 | v60.96,23.87 63.86,20.96 | 41.66,13.01 GPIO16.GND | v73.86,29.46 73.86,30.36 75.06,31.57 75.06,32.16 v74.66,32.16 | R5.1 15.69,12.92 | 15.69,12.92 C2.1 15.64,13.16 | 15.64,13.16 C1.1 13.31,15.55 13.3,15.56 | v19.56,11.46 17.15,11.46 15.69,12.92 | C7.1 14.16,23.42 | 14.16,23.42 13.35,23.42 13.3,23.46 | C6.1 15.46,20.77 13.3,20.77 | C3.1 13.48,18.29 13.3,18.46 | U1.10 13.27,18.89 13.3,18.87 | U$2.30 56.52,38.16 59.36,38.16 60.29,39.09 U$2.34 | v33.06,14.87 33.06,14.12 32.21,13.26 | v42.56,19.67 41.57,20.66 41.57,21.67 | v41.56,23.96 41.56,22.17 41.41,22.02 | v62.66,8.87 62.66,11.46 v62.76,11.56 62.76,14.06 v62.66,14.17 62.66,16.57 v62.76,16.67 | v62.96,19.37 62.96,20.07 63.86,20.96 | v55.06,27.67 56.76,27.67 v56.86,27.77 | v51.86,28.37 49.86,28.37 v49.66,28.17 | v0.26,3.77 v0.26,6.16 v0.26,8.76 v0.26,11.26 v2.96,11.26 v2.96,14.76 | v5.26,9.66 7.56,7.37 v7.56,7.06 | v18.36,21.96 v18.36,24.67 18.06,24.37 14.46,24.37 v14.26,24.17 14.26,23.52 14.16,23.42 | v16.76,5.46 18.96,5.46 20.46,3.97 v20.46,3.86
  Bottom 0.152: v22.26,5.27 22.26,5.37 v20.76,6.87 18.66,8.96 v18.66,9.16 | v71.26,35.66 70.76,35.16 70.76,33.66 v70.86,33.56 | v74.66,35.56 74.76,35.46 | v23.56,33.27 25.06,31.77 v25.76,31.77 28.26,29.27 28.56,29.27 29.36,28.46 29.36,27.17 29.86,26.67 29.86,25.77 v29.76,25.67 29.76,25.46 31.46,23.77 31.46,22.32 32.21,21.57 | v20.26,35.16 23.96,35.16 v24.06,35.06 | v17.06,34.36 16.06,34.36 15.06,35.36 v12.56,35.36 v9.56,35.36 v6.46,35.36 v3.36,35.36 v0.36,35.36 v0.36,33.16 | C9.1 24.46,9.71 v24.46,10.06 | v24.26,17.46 24.56,17.77 24.56,19.71 R13.1 22.91,20.82 21.36,19.27 20.46,19.27 19.96,18.77 18.96,18.77 18.1,17.9 18.1,17.75 18.06,17.71 v18.06,16.77 | PWM0.GND 74.94,17.89 v74.96,17.87 | v74.96,15.26 v74.96,12.76 | 74.86,3.56 v74.96,3.66 v74.96,7.37 v74.96,10.26 | A2.GND 44.76,4.37 46.46,6.06 R18.1 48.36,6.06 v47.16,4.87 | A1.GND 38.06,4.77 38.06,5.56 38.56,6.06 R17.1 38.36,7.31 v38.36,7.37 | I2C1.GND 49.76,11.79 v49.76,10.76 | R11.1 26.61,2.61 A0.GND 27.16,2.06 29.36,2.06 30.56,3.27 30.56,4.56 30.06,5.06 30.06,5.56 30.96,6.46 R12.1 31.71,7.12 v32.56,7.96 | v13.86,13.37 15.44,13.37 15.64,13.16 | v29.81,15.71 29.81,14.92 31.68,13.04 32.21,13.04 | v48.56,29.96 SERIAL.GND | v32.86,27.87 32.21,28.52 GPIO4.GND | v46.36,19.77 47.76,21.17 v47.96,21.17
  Bottom 0.2: v37.96,25.46 41.41,22.02 41.57,21.86 GPIO12.GND 41.57,21.67 41.57,13.14 GPIO16.GND | GPIO6.GND 32.21,21.57 32.21,13.26 32.21,13.04 GPIO13.GND
  Bottom 0.406: PWM0.GND 72.99,18.64 70.61,21.02 67.36,24.27 67.36,34.77 68.06,35.46 68.06,36.78 U$2.39
  pour Bottom (rank 5): -1.94,-3.71 76.8,-3.71 76.8,42.02 -1.94,42.02
  pour Top (rank 5): -1.94,-3.71 76.7,-3.71 76.7,42.02 -1.94,42.02
GPIO4  (via drill 0.35)
  Top 0.152: IC2.1 23.36,24.19 v23.36,25.17 | U$2.7 27.27,34.88 26.76,34.36 25.76,34.36 23.56,32.16 23.56,31.36 21.96,29.77 21.96,29.37 v22.86,28.46
  Bottom 0.152: v23.36,25.17 22.86,25.67 v22.86,28.46
GPIO5  (via drill 0.35)
  Top 0.152: IC2.3 18.43,22.89 17.66,23.67 17.66,27.96 v22.16,32.46 | v26.92,28.91 27.35,28.91 v31.11,32.66
  Bottom 0.152: v31.11,32.66 31.26,32.66 33.56,34.96 35.07,34.96 36.43,33.61 48.4,33.61 49.76,34.96 53.46,34.96 55.21,36.71 U$2.29 | v26.92,28.91 26.76,29.07 23.76,29.07 23.46,29.37 23.46,31.17 v22.16,32.46
GPIO6  (via drill 0.35)
  Top 0.152: U$2.31 55.78,34.96 49.76,34.96 49.16,35.56 47.16,35.56 46.06,34.46 44.95,34.46 44.6,34.81 v43.3,34.81 | IC2.4 23.73,22.24 23.96,22.46 23.96,31.86 26.05,33.96 26.79,33.96 27.36,33.96 28.96,35.56 35.66,35.56 36.16,36.06 36.16,37.77 36.56,38.16 40.86,38.16 41.26,37.77 v41.26,36.12
  Bottom 0.152: v43.3,34.81 42.1,34.81 41.26,35.65 v41.26,36.12
GPIO12
  Top 0.152: U$2.32 58.55,38.67 58.55,38.39 58.96,37.98 58.96,35.56 58.36,34.96 57.16,34.96 55.06,32.86 51.06,32.86 48.86,35.06 47.66,35.06 46.56,33.96 41.66,33.96 40.56,35.06 39.26,35.06 38.96,34.77 38.36,34.77 37.96,35.16 29.26,35.16 27.56,33.46 26.26,33.46 24.46,31.67 24.46,21.87 24.18,21.59 IC2.5
GPIO13
  Top 0.152: IC2.6 22.54,20.96 17.76,20.96 17.06,21.67 17.06,28.67 15.46,30.27 15.46,35.16 17.86,37.56 17.86,40.46 18.26,40.86 58.76,40.86 59.06,40.56 59.06,38.77 59.56,38.27 59.56,37.66 U$2.33
GPIO16  (via drill 0.35)
  Top 0.152: v20.36,20.07 20.58,20.29 IC2.7 | v27.96,28.27 29.76,28.27 30.36,28.87 v30.96,28.87
  Bottom 0.152: v20.36,20.07 20.36,20.87 27.76,28.27 v27.96,28.27 | v30.96,28.87 30.96,30.67 33.06,32.77 57.36,32.77 59.26,34.66 60.86,34.66 61.56,35.36 61.56,38.2 U$2.36
H_SCL  (via drill 0.3)
  Top 0.152: v61.31,27.07 61.86,27.07 61.89,27.09 | R8.1 62.46,27.67 61.89,27.09 | IC1.6 61.89,27.09 | I2C0.SCL 58.76,11.21 I2C1.SCL
  Bottom 0.152: I2C1.SCL 56.97,21.5 I2C2.SCL 56.76,23.67 57.86,24.77 59.51,24.77 61.31,26.57 v61.31,27.07
H_SDA  (via drill 0.35)
  Top 0.152: IC1.5 62.53,26.74 63.26,27.46 63.26,28.96 62.96,29.27 R8.2 62.16,29.27 61.66,28.77 61.66,28.17 61.26,27.77 60.16,27.77 v60.06,27.67 | I2C2.SDA 54.77,22.98 56.56,24.77 v56.66,24.77 | I2C1.SDA 54.97,9.15 v57.06,7.06
  Bottom 0.152: I2C2.SDA 54.77,13.21 I2C1.SDA | v60.06,27.67 60.06,27.57 60.54,27.09 60.54,26.64 59.73,25.83 57.8,25.83 56.93,24.96 56.86,24.96 v56.66,24.77 | v57.06,7.06 57.36,7.06 60.76,3.66 I2C0.SDA
MISO  (via drill 0.35)
  Top 0.152: IC3.12 25.49,12.8 26.16,13.46 26.16,17.77 25.26,18.66 25.26,29.59 28.9,33.23 29.18,33.23 30.42,34.47 32.79,34.47 32.79,34.46 37.22,34.46 v37.26,34.42 | 38.76,35.46 v38.66,35.56 40.76,35.56 41.16,35.16 42.66,35.16 43.16,35.66 44.46,35.66 45.05,36.25 U$2.21
  Bottom 0.152: v37.26,34.42 38.4,35.56 v38.66,35.56
MOSI  (via drill 0.35)
  Top 0.152: v29.26,34.31 24.86,29.91 24.86,18.17 25.66,17.37 25.66,15.87 23.86,14.06 IC3.11
  Bottom 0.152: U$2.19 41.28,38.16 31.66,38.16 31.06,37.56 31.06,36.06 29.3,34.31 v29.26,34.31
N$2
  Top 0.2: U$9.6 68.69,27.33 68.56,27.46 68.56,29.07 69.66,30.17 74.16,30.17 75.16,29.17 75.16,24.77 74.82,24.43 R3.1
N$3  (via drill 0.35)
  Top 0.2: R3.2 74.02,24.93 v74.46,25.37 | v69.76,28.77 69.26,28.27 69.26,26.38 U$9.7
  Bottom 0.2: v74.46,25.37 74.46,27.07 72.76,28.77 v69.76,28.77
N$4
  Top 0.152: U$9.1 65.44,25.35 65.22,25.12 R1.7
N$5  (via drill 0.35)
  Top 0.2: v73.06,25.17 73.22,25.01 R3.3 | v70.46,28.07 69.99,27.6 U$9.8
  Bottom 0.2: v73.06,25.17 73.06,27.17 72.06,28.17 70.56,28.17 v70.46,28.07
N$6
  Top 0.2: U$9.9 70.64,25.88 71.16,25.37 71.86,25.37 72.06,25.17 72.06,24.58 R3.4
N$7  (via drill 0.35)
  Top 0.2: R2.6 69.96,25.07 v70.16,25.27 | v68.56,30.36 68.56,31.07 68.76,31.27 68.76,32.08 U$9.23
  Bottom 0.2: v70.16,25.27 70.16,26.67 68.56,28.27 v68.56,30.36
N$8
  Top 0.152: R1.8 64.42,27.02 67.39,30 U$9.25
N$9
  Top 0.152: GPIO4.I/O 36.21,29.42 35.56,28.77 32.36,28.77 30.86,27.27 30.86,25.07 29.98,24.19 IC2.20
N$10
  Top 0.152: R1.6 66.02,26.22 U$9.2
N$11
  Top 0.152: U$9.3 66.74,24.38 R1.5
N$12
  Top 0.152: U$9.4 67.46,26.23 67.46,25.17 R2.8
N$13
  Top 0.152: U$9.5 68.06,26.28 68.06,25.46 68.53,24.99 68.6,24.99 68.63,24.96 68.96,24.96 69.16,24.77 R2.7
N$14  (via drill 0.3)
  Top 0.152: v10.31,27.07 12.31,29.07 15.26,29.07 15.56,28.77 15.56,25.57 v16.06,25.07
  Bottom 0.152: U1.27 10.64,27.39 v10.31,27.07 | v16.06,25.07 17.15,26.16 C5.2
N$15
  Top 0.152: GPIO5.I/O 45.57,28.18 42.86,25.46 39.86,25.46 39.06,24.67 39.06,21.57 37.66,20.17 36.26,20.17 35.96,20.46 35.06,20.46 33.76,19.17 32.36,19.17 31.06,20.46 31.06,22.37 30.54,22.89 IC2.18
N$16  (via drill 0.3)
  Top 0.152: v14.31,25.82 14.31,26.62 14.96,27.27 14.96,28.27 14.76,28.46 13.46,28.46 v13.31,28.32
  Bottom 0.152: v13.31,28.32 12.81,27.82 12.81,27.12 12.66,26.96 11.69,26.96 U1.26 | v14.31,25.82 14.65,26.16 C5.1
N$17  (via drill 0.35)
  Top 0.152: v34.96,19.27 34.36,18.67 32.16,18.67 30.66,20.17 30.66,21.87 30.29,22.24 IC2.17
  Bottom 0.152: v34.96,19.27 36.21,20.52 GPIO6.I/O
N$18
  Top 0.152: GPIO12.I/O 45.66,21.61 45.66,20.46 43.36,18.17 31.96,18.17 30.26,19.87 30.26,21.27 29.93,21.59 IC2.16
N$19
  Bottom 0.152: U1.28 8.29,27.89 8.26,27.87 8.16,27.87 7.16,28.87 7.16,31.42 7.71,31.96 11.16,31.96 11.8,31.32 12.99,31.32 13.05,31.27 14.96,31.27 16.06,30.17 17.96,30.17 18.26,29.86 18.26,28.52 17.81,28.07 16.56,28.07 15.72,28.91 C4.1
N$20
  Top 0.152: GPIO13.I/O 36.16,13.05 36.16,17.37 35.86,17.67 31.86,17.67 29.86,19.67 29.86,20.46 29.38,20.94 IC2.15
N$21
  Bottom 0.152: C4.2 16.37,29.82 13.51,29.82 13.06,29.37 13.06,28.96 12.56,28.46 11.69,28.46 U1.29
N$22
  Top 0.152: GPIO16.I/O 45.68,12.68 44.46,11.46 31.26,11.46 30.46,12.26 30.46,13.96 31.36,14.87 31.36,16.67 29.36,18.67 29.36,20.17 29.23,20.29 IC2.14
N$23
  Bottom 0.152: R5.2 17.39,10.09 16.36,9.06 9.21,9.06 7.01,11.26 7.01,16.02 7.56,16.57 10.56,16.57 10.73,16.39 U1.5
N$24  (via drill 0.3, 0.35)
  Top 0.152: v10.31,15.81 16.56,15.81 18.11,14.26 v18.56,14.26
  Bottom 0.152: v18.56,14.26 18.56,15.17 18.17,15.55 C1.2 | U1.4 10.39,15.89 v10.31,15.81
N$25  (via drill 0.3)
  Top 0.152: v16.56,14.06 15.81,14.81 13.36,14.81 v10.31,14.81
  Bottom 0.152: v16.56,14.06 17.31,14.06 17.34,14.03 C2.2 | U1.3 10.79,15.39 10.31,14.92 v10.31,14.81
N$26  (via drill 0.3)
  Top 0.152: v10.31,24.07 v13.81,27.57
  Bottom 0.152: 10.54,23.84 v10.31,24.07 | U1.20 11.57,23.84 10.54,23.84 | R6.1 17.96,27.57 v13.81,27.57 | U1.17 10.63,22.39 10.46,22.57 10.46,23.77 10.54,23.84
N$27
  Bottom 0.152: C3.2 19.1,20.07 19.1,22.07 | R7.1 19.56,25.78 19.56,24.57 19.1,24.11 19.1,22.07 | 19.1,22.07 19.36,22.07 21.7,24.41 21.7,26.92 20.94,27.69 R6.2 20.94,29.68 D1.ANODE
N$28  (via drill 0.35)
  Top 0.152: v20.66,17.96 21.04,18.34 IC2.10
  Bottom 0.152: R13.2 21.81,19.12 v20.66,17.96 20.66,16.82 R16.1
N$30
  Bottom 0.305: SJ1.2 53.56,28.27 52.86,28.96 SERIAL.VCC
N$31  (via drill 0.35)
  Top 0.152: v40.56,7.46 38.16,9.87 29.96,9.87 29.56,10.26 IC3.3
  Bottom 0.152: R14.2 R17.2 40.56,6.81 v40.56,7.46
N$33  (via drill 0.35)
  Top 0.152: v62.96,23.87 62.06,23.87 61.23,24.69 IC1.7 61.23,26.39 61.16,26.46 60.66,26.46 60.59,26.39 IC1.8
  Bottom 0.152: R9.1 61.41,31.92 60.26,33.06 60.26,33.96 60.46,34.16 62.06,34.16 62.86,33.36 62.86,23.96 v62.96,23.87
N$34  (via drill 0.35)
  Top 0.152: v29.46,3.97 29.46,6.32 IC3.1
  Bottom 0.152: R11.2 28.41,4.77 | 25.01,4.46 R4.2 25.01,5.52 25.36,5.87 27.96,5.87 28.31,5.52 R11.2 | 28.31,4.12 R11.2 | R11.2 29.01,3.97 v29.46,3.97
N$35  (via drill 0.35)
  Top 0.152: v71.56,21.96 71.56,23.46 R2.5
  Bottom 0.152: SJ2.1 72.06,21.46 v71.56,21.96
N$36  (via drill 0.35)
  Top 0.152: IC3.2 34.23,8.99 v35.46,7.76
  Bottom 0.152: 33.71,5.27 R10.2 33.41,4.96 R12.2 35.26,6.46 35.46,6.66 v35.46,7.76
N$38  (via drill 0.35)
  Top 0.152: IC3.4 30.09,11.53 31.06,10.56 46.66,10.56 47.16,10.06 v47.16,7.26
  Bottom 0.152: R15.2 R18.2 49.51,7.26 v47.16,7.26
PWM0
  Top 0.152: PWM0.I/O 67.91,19.32 68.26,19.67 73.86,19.67 74.86,20.67 74.86,22.58 R3.8
PWM1
  Top 0.152: PWM1.I/O 66.58,15.35 66.36,15.56 66.36,19.46 67.16,20.27 73.26,20.27 74.06,21.07 74.06,22.58 R3.7
PWM2
  Top 0.152: PWM2.I/O 66.22,12.8 65.86,13.16 65.86,19.96 66.66,20.77 72.86,20.77 73.22,21.12 R3.6
PWM3
  Top 0.152: R3.5 72.42,21.53 72.16,21.27 66.36,21.27 65.26,20.17 65.26,10.46 65.54,10.18 67.8,10.18 PWM3.I/O
RX  (via drill 0.35)
  Top 0.152: SERIAL.RX 56.86,33.46 v57.56,34.16
  Bottom 0.152: U$2.10 28.46,38.12 28.46,37.66 28.56,37.56 28.56,36.16 27.56,35.16 27.56,33.86 27.96,33.46 28.86,33.46 28.96,33.36 28.96,31.96 29.36,31.57 31.06,31.57 33.96,34.46 34.66,34.46 35.92,33.21 49,33.21 50.26,34.46 55.96,34.46 56.26,34.16 v57.56,34.16
SCL  (via drill 0.35)
  Top 0.152: R8.3 62.56,30.17 66.36,30.17 66.74,30.55 U$9.26 66.74,32.98 v66.66,33.06 | IC1.3 61.89,21.44 62.26,21.07 62.26,19.96 61.46,19.17 59.66,19.17 59.36,18.87 | v5.76,20.77 5.76,16.46 v5.66,16.37 | v59.46,18.07 59.36,18.17 59.36,18.87 | v63.16,35.16 60.66,35.16 59.46,33.96 59.46,33.01 59.56,32.91 59.56,29.96 57.96,28.37 57.96,27.07 59.36,25.67 59.36,24.37 59.76,23.96 59.76,23.07 58.26,21.57 58.26,19.46 58.86,18.87 59.36,18.87 | v17.86,32.56 21.06,32.56 21.66,33.16 21.66,33.86 U$2.5 | v61.86,6.96 62.16,6.96 64.26,4.87 v67.56,4.87 | v17.06,3.77 16.86,3.77 v14.86,5.76
  Bottom 0.152: v17.86,32.56 6.76,32.56 6.06,31.86 6.06,22.67 | 6.06,22.67 6.06,21.07 v5.76,20.77 | v5.66,16.37 5.76,16.27 5.76,10.46 9.76,6.46 14.16,6.46 v14.86,5.76 | v61.86,6.96 61.16,6.96 58.86,9.26 58.86,13.06 59.46,13.67 v59.46,18.07 | v63.16,35.16 65.76,35.16 66.66,34.27 v66.66,33.06 | U1.13 10.03,20.39 9.26,21.17 7.56,21.17 6.06,22.67 | v67.56,4.87 67.76,4.66 67.76,-0.64 67.06,-1.33 20.86,-1.33 18.26,1.27 18.26,2.56 v17.06,3.77
SCLK  (via drill 0.35)
  Top 0.152: IC3.13 25.62,11.53 26.76,12.67 26.76,18.06 25.66,19.17 25.66,29.24 29.49,33.06 29.86,33.06 30.96,34.16 32.66,34.16 33.16,33.66 39.16,33.66 v39.86,34.36 | v46.04,35.59 47.39,36.93 U$2.23
  Bottom 0.152: v46.04,35.59 44.52,34.06 40.16,34.06 v39.86,34.36
SDA  (via drill 0.35)
  Top 0.152: U$9.27 66.09,31.3 65.76,30.96 62.56,30.96 R8.4 62.46,31.67 62.56,31.77 v63.56,31.77 | v60.16,16.96 60.36,16.77 60.36,8.87 61.36,7.87 66.56,7.87 v69.16,5.27 | v64.56,19.77 63.96,20.37 63.96,21.7 63.66,22 | 63.66,22 63.66,26.17 63.96,26.46 63.96,27.77 v65.36,29.17 | 63.66,22 63.66,21.96 62.96,21.27 62.86,21.27 62.53,21.59 IC1.4 | U$2.3 22.19,35.59 20.86,34.27 19.86,34.27 19.46,33.86 v19.46,33.36
  Bottom 0.152: 4.46,20.77 4.46,32.27 6.16,33.96 15.76,33.96 16.36,33.36 v19.46,33.36 | 8.86,19.39 5.83,19.39 4.46,20.77 | 8.86,19.39 U1.11 | U1.12 9.36,19.89 8.86,19.39 | 4.46,20.77 4.46,8.87 8.26,5.06 8.26,3.56 13.96,-2.14 68.66,-2.14 69.16,-1.64 v69.16,5.27 | v60.16,16.96 61.36,18.17 63.76,18.17 64.56,18.96 v64.56,19.77 | v65.36,29.17 64.36,30.17 64.36,31.36 63.96,31.77 v63.56,31.77
TX  (via drill 0.35)
  Top 0.152: 32.96,32.77 32.91,32.71 | 32.91,32.71 30.96,30.77 30.06,30.77 v29.86,30.57 | 32.91,32.71 37.11,32.71 37.26,32.86 38.46,32.86 38.66,32.66 45.96,32.66 46.16,32.86 47.76,32.86 48.46,32.16 53.46,32.16 54.86,30.77 SERIAL.TX
  Bottom 0.152: v29.86,30.57 29.56,30.57 28.26,31.86 28.26,32.36 27.96,32.66 27.66,32.66 25.86,34.46 25.86,35.86 25.96,35.96 25.96,38.27 27.17,39.47 U$2.8

### Text on the board
tPlace: Designed in Aizu | #519 | REV 1.0.11
bPlace: F-519-1-11-A-N-J-0-P